# EAGLE design defluxio (EAGLE 6.6.0)
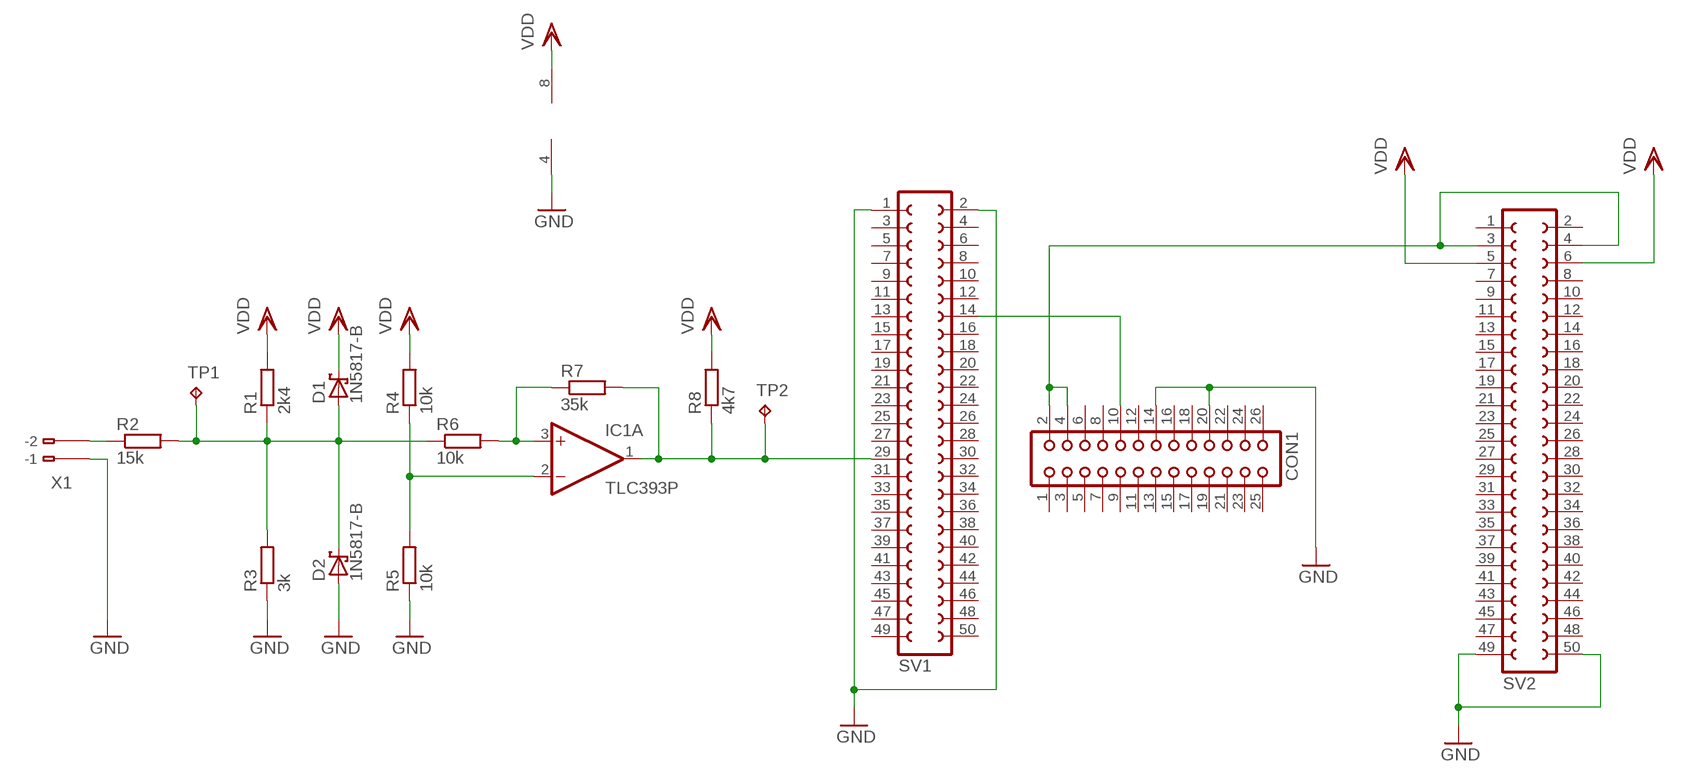
[diagram p0: schematic, sheet 1]

## Parts
CON1  CON26  [CON26]
D1  1N5817-B  [DO41-7.6]
D2  1N5817-B  [DO41-7.6]
IC1  TLC393P  [DIL08]
R1  2k4  R-EU_0204/7  [0204/7]
R2  15k  R-EU_0207/12  [0207/12]
R3  3k  R-EU_0207/15  [0207/15]
R4  10k  R-EU_0207/12  [0207/12]
R5  10k  R-EU_0207/10  [0207/10]
R6  10k  R-EU_0204/7  [0204/7]
R7  35k  R-EU_0207/10  [0207/10]
R8  4k7  R-EU_0207/10  [0207/10]
SV1  FE25-2  [FE25-2]
SV2  FE25-2  [FE25-2]
TP1  TPPAD1-13  [P1-13]
TP2  TPPAD1-13  [P1-13]
X1  233-102  [233-102]

## Nets
5V: CON1.2 CON1.4 SV2.3 SV2.4
GND: CON1.14 CON1.20 D2.A IC1.4(P:V-) R3.1 R5.1 SV1.1 SV1.2 SV2.49 SV2.50 X1.B1(B-1)
N$1: R2.1 X1.B2(B-2)
N$2: IC1.3(A:+IN) R6.2 R7.1
N$3: IC1.2(A:-IN) R4.1 R5.2
PE11: IC1.1(A:OUT) R7.2 R8.1 SV1.29 TP2.TP
RX: CON1.10 SV1.14
SIG: D1.A D2.C R1.1 R2.2 R3.2 R6.1 TP1.TP
VDD: D1.C IC1.8(P:V+) R1.2 R4.2 R8.2 SV2.5 SV2.6
Unconnected: CON1.1 CON1.3 CON1.5 CON1.6 CON1.7 CON1.8 CON1.9 CON1.11 CON1.12 CON1.13 CON1.15 CON1.16 CON1.17 CON1.18 CON1.19 CON1.21 CON1.22 CON1.23 CON1.24 CON1.25 CON1.26 IC1.5(B:+IN) IC1.6(B:-IN) IC1.7(B:OUT) SV1.3 SV1.4 SV1.5 SV1.6 SV1.7 SV1.8 SV1.9 SV1.10 SV1.11 SV1.12 SV1.13 SV1.15 SV1.16 SV1.17 SV1.18 SV1.19 SV1.20 SV1.21 SV1.22 SV1.23 SV1.24 SV1.25 SV1.26 SV1.27 SV1.28 SV1.30 SV1.31 SV1.32 SV1.33 SV1.34 SV1.35 SV1.36 SV1.37 SV1.38 SV1.39 SV1.40 SV1.41 SV1.42 SV1.43 SV1.44 SV1.45 SV1.46 SV1.47 SV1.48 SV1.49 SV1.50 SV2.1 SV2.2 SV2.7 SV2.8 SV2.9 SV2.10 SV2.11 SV2.12 SV2.13 SV2.14 SV2.15 SV2.16 SV2.17 SV2.18 SV2.19 SV2.20 SV2.21 SV2.22 SV2.23 SV2.24 SV2.25 SV2.26 SV2.27 SV2.28 SV2.29 SV2.30 SV2.31 SV2.32 SV2.33 SV2.34 SV2.35 SV2.36 SV2.37 SV2.38 SV2.39 SV2.40 SV2.41 SV2.42 SV2.43 SV2.44 SV2.45 SV2.46 SV2.47 SV2.48 X1.A1(-1) X1.A2(-2)

## Library data of the parts
CON1 = con-harting:CON26: CONNECTOR; OC_FARNELL: unknown; OC_NEWARK: unknown
D1 D2 = diode:1N581*: 1.0A SCHOTTKY BARRIER RECTIFIER Source: http://www.diodes.com/datasheets/ds23001.pdf
IC1 = linear:TLC393: COMPARATOR
R1-R8 = resistor:R-EU_: RESISTOR, European symbol
SV1 SV2 = con-lsta:FE25-2: FEMALE HEADER; OC_FARNELL: unknown; OC_NEWARK: unknown
TP1 TP2 = testpad:TP: Test pad
X1 = con-wago:233-102: WAGO Cage Clamp; MPN: 233-102; OC_FARNELL: unknown; OC_NEWARK: 28K9044

## Board
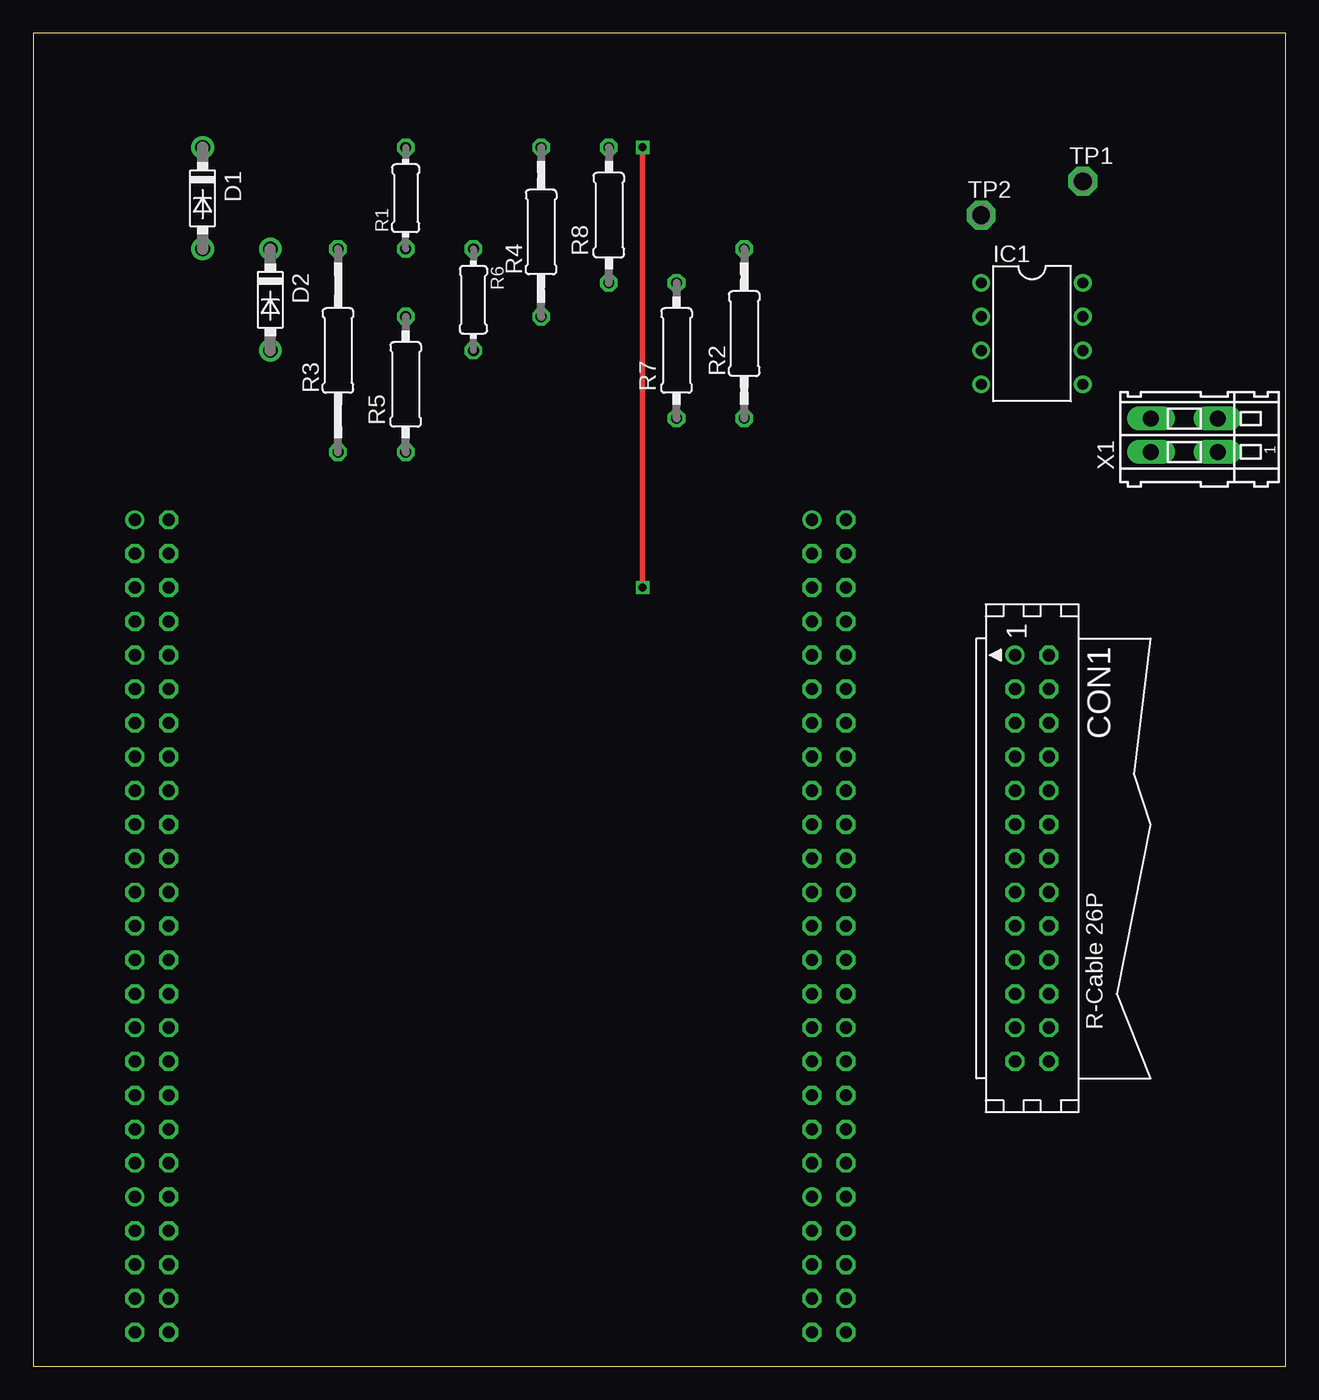
[diagram p1: board, top side]
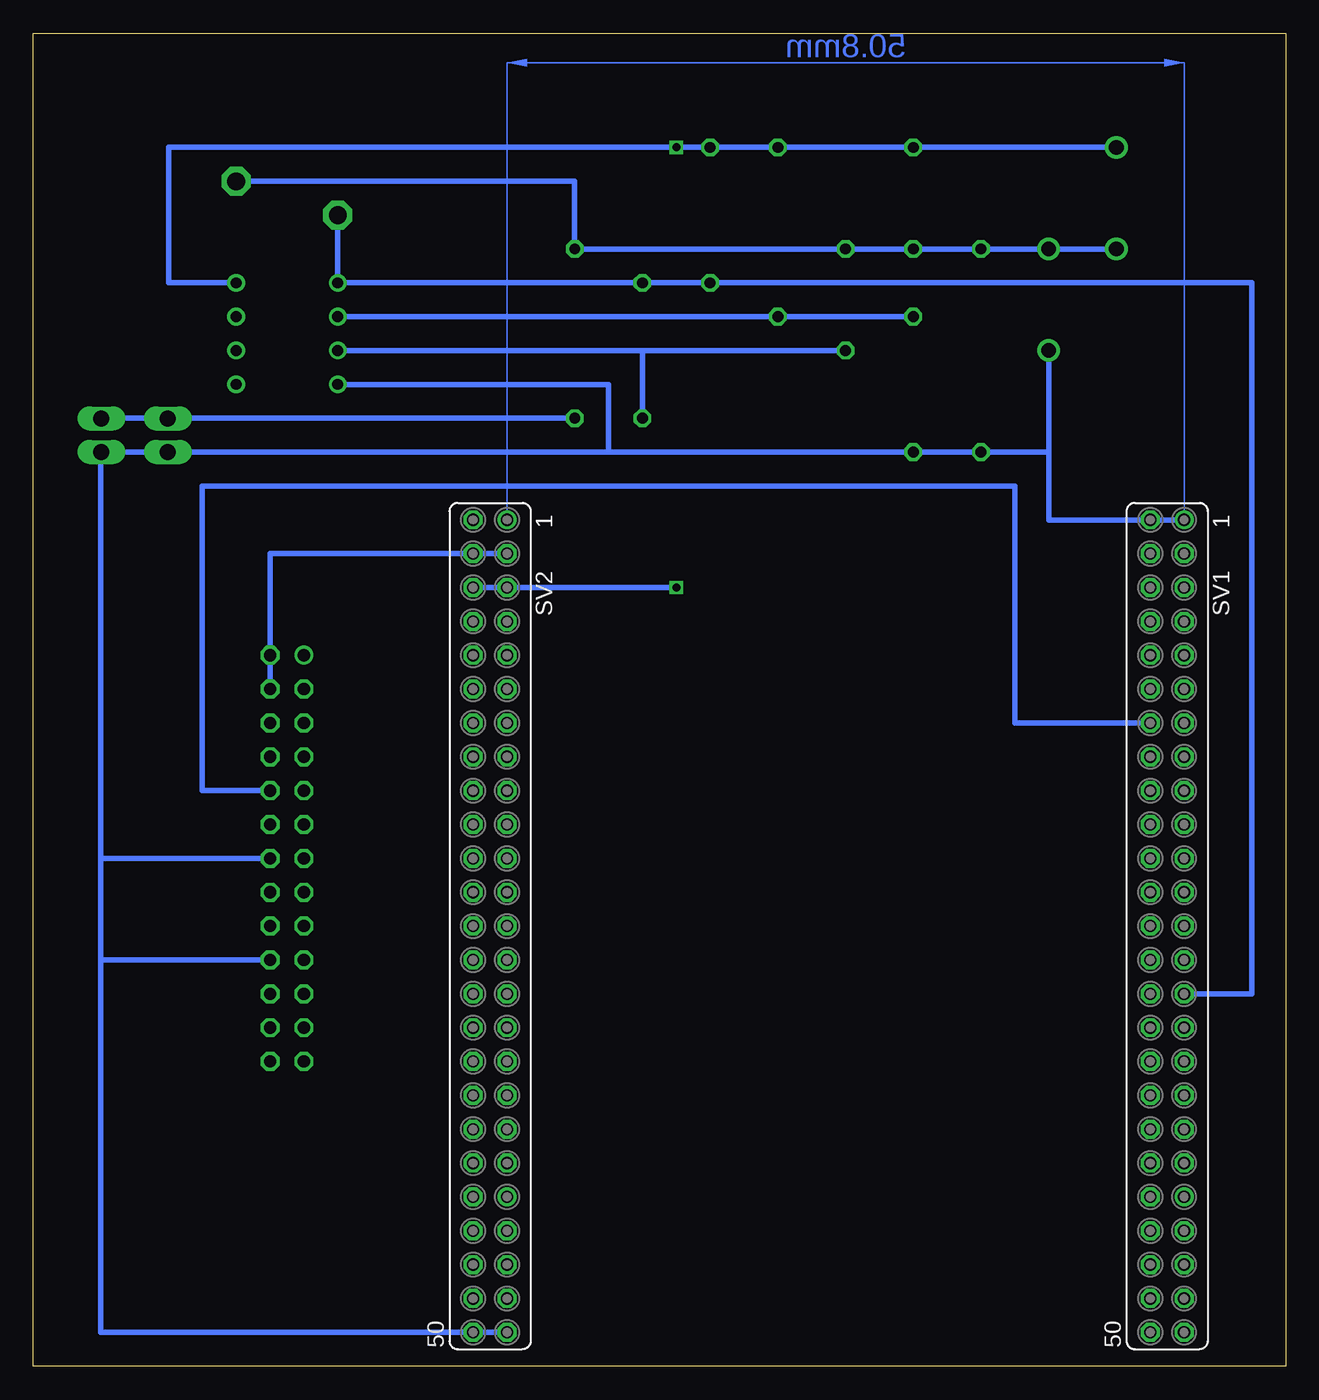
[diagram p2: board, bottom side, seen from below]

Size 93.96 x 100 mm. Coordinates in mm from the lower left corner, seen from the top.
Outline: 0,0 93.96,0 93.96,100 0,100 0,0
Copper layers (1*16): Top 0.035mm / dielectric 1.5mm / Bottom 0.035mm
Design rules "default": minimum track width 10mil, minimum drill 24mil, track to track 8mil, track to pad 8mil, pad to pad 8mil, via to via 8mil, smd to smd 8mil, copper to edge 40mil, drill to drill 8mil, minimum pad ring 10mil, minimum via ring 8mil, stop-mask expansion 4mil, vias tented up to drill 0mil, thermal gap 10mil

### Footprints (pad centres in the part's own frame; a part is rotated, then mirrored left to right if it is on the bottom)
CON26 = drill 0.914: 1 -15.24,-1.27 | drill 0.914 octagon: 2 -15.24,1.27; 3 -12.7,-1.27; 4 -12.7,1.27; 5 -10.16,-1.27; 6 -10.16,1.27; 7 -7.62,-1.27; 8 -7.62,1.27; 9 -5.08,-1.27; 10 -5.08,1.27; 11 -2.54,-1.27; 12 -2.54,1.27; 13 0,-1.27; 14 0,1.27; 15 2.54,-1.27; 16 2.54,1.27; 17 5.08,-1.27; 18 5.08,1.27; 19 7.62,-1.27; 20 7.62,1.27; 21 10.16,-1.27; 22 10.16,1.27; 23 12.7,-1.27; 24 12.7,1.27; 25 15.24,-1.27; 26 15.24,1.27
DO41-7.6 = drill 1.1 pad 1.7: A 3.81,0; C -3.81,0
DIL08 = drill 0.813 pad 1.27: 1 -3.81,-3.81; 2 -1.27,-3.81; 3 1.27,-3.81; 4 3.81,-3.81; 5 3.81,3.81; 6 1.27,3.81; 7 -1.27,3.81; 8 -3.81,3.81
0204/7 = drill 0.813 octagon: 1 -3.81,0; 2 3.81,0
0207/12 = drill 0.813 octagon: 1 -6.35,0; 2 6.35,0
0207/15 = drill 0.813 octagon: 1 -7.62,0; 2 7.62,0
0207/10 = drill 0.813 octagon: 1 -5.08,0; 2 5.08,0
FE25-2 = drill 0.914: 1 -30.48,1.27; 41 20.32,1.27 | drill 0.914 octagon: 2 -30.48,-1.27; 3 -27.94,1.27; 4 -27.94,-1.27; 5 -25.4,1.27; 6 -25.4,-1.27; 7 -22.86,1.27; 8 -22.86,-1.27; 9 -20.32,1.27; 10 -20.32,-1.27; 11 -17.78,1.27; 12 -17.78,-1.27; 13 -15.24,1.27; 14 -15.24,-1.27; 15 -12.7,1.27; 16 -12.7,-1.27; 17 -10.16,1.27; 18 -10.16,-1.27; 19 -7.62,1.27; 20 -7.62,-1.27; 21 -5.08,1.27; 22 -5.08,-1.27; 23 -2.54,1.27; 24 -2.54,-1.27; 25 0,1.27; 26 0,-1.27; 27 2.54,1.27; 28 2.54,-1.27; 29 5.08,1.27; 30 5.08,-1.27; 31 7.62,1.27; 32 7.62,-1.27; 33 10.16,1.27; 34 10.16,-1.27; 35 12.7,1.27; 36 12.7,-1.27; 37 15.24,1.27; 38 15.24,-1.27; 39 17.78,1.27; 40 17.78,-1.27; 42 20.32,-1.27; 43 22.86,1.27; 44 22.86,-1.27; 45 25.4,1.27; 46 25.4,-1.27; 47 27.94,1.27; 48 27.94,-1.27; 49 30.48,1.27; 50 30.48,-1.27
P1-13 = drill 1.321 pad 2.159 octagon: TP 0,0
233-102 = drill 1.2 long: A1 -1.25,2.5; A2 1.25,2.5; B1 -1.25,-2.5; B2 1.25,-2.5

### Placement (x,y rotation side)
CON1  74.93,38.1 270 top
D1  12.7,87.63 270 top
D2  17.78,80.01 270 top
IC1  74.93,77.47 270 top
R1  27.94,87.63 90 top
R2  53.34,77.47 90 top
R3  22.86,76.2 90 top
R4  38.1,85.09 90 top
R5  27.94,73.66 90 top
R6  33.02,80.01 270 top
R7  48.26,76.2 90 top
R8  43.18,86.36 90 top
SV1  8.89,33.02 270 bottom
SV2  59.69,33.02 270 bottom
TP1  78.74,88.9 0 top
TP2  71.12,86.36 0 top
X1  86.36,69.85 90 top

### Tracks (layer width: path | path; a pad name or v marks a point on that pad's centre or on a via)
5V
  Bottom 0.406: CON1.4 CON1.2 76.2,60.96 SV2.4 SV2.3
GND
  Bottom 0.406: 50.8,68.6 X1.B1 88.9,68.6 88.9,38.1 | 50.8,68.6 40.64,68.6 R5.1 R3.1 17.78,68.58 | 88.9,38.1 CON1.14 | 88.9,30.48 88.9,2.54 SV2.50 SV2.49 | 88.9,30.48 88.9,38.1 | CON1.20 88.9,30.48 | SV1.1 SV1.2 17.78,63.5 17.78,68.58 | 17.78,68.58 D2.A | IC1.4 50.8,73.66 50.8,68.6
N$1
  Bottom 0.406: R2.1 88.86,71.12 X1.B2
N$2
  Bottom 0.406: R6.2 48.26,76.2 | 48.26,76.2 IC1.3 | R7.1 48.26,76.2
N$3
  Bottom 0.406: IC1.2 R4.1 R5.2
PE11
  Bottom 0.406: SV1.29 2.54,27.94 2.54,81.28 R8.1 R7.2 IC1.1 TP2.TP
RX
  Bottom 0.406: CON1.10 81.28,43.18 81.28,66.04 20.32,66.04 20.32,48.26 SV1.14
SIG
  Bottom 0.406: R3.2 R6.1 | R6.1 R1.1 R3.2 | R6.1 R2.2 53.34,88.9 TP1.TP | R3.2 D2.C | R3.2 D1.A
VDD  (via drill 0.6)
  Top 0.406: v45.72,58.42 v45.72,91.44
  Bottom 0.406: SV2.5 SV2.6 v45.72,58.42 | v45.72,91.44 R8.2 R4.2 R1.2 D1.C v45.72,91.44 | v45.72,91.44 83.82,91.44 83.82,81.28 IC1.8
(copper drawn outside any net)
  shapes: Bottom area x1